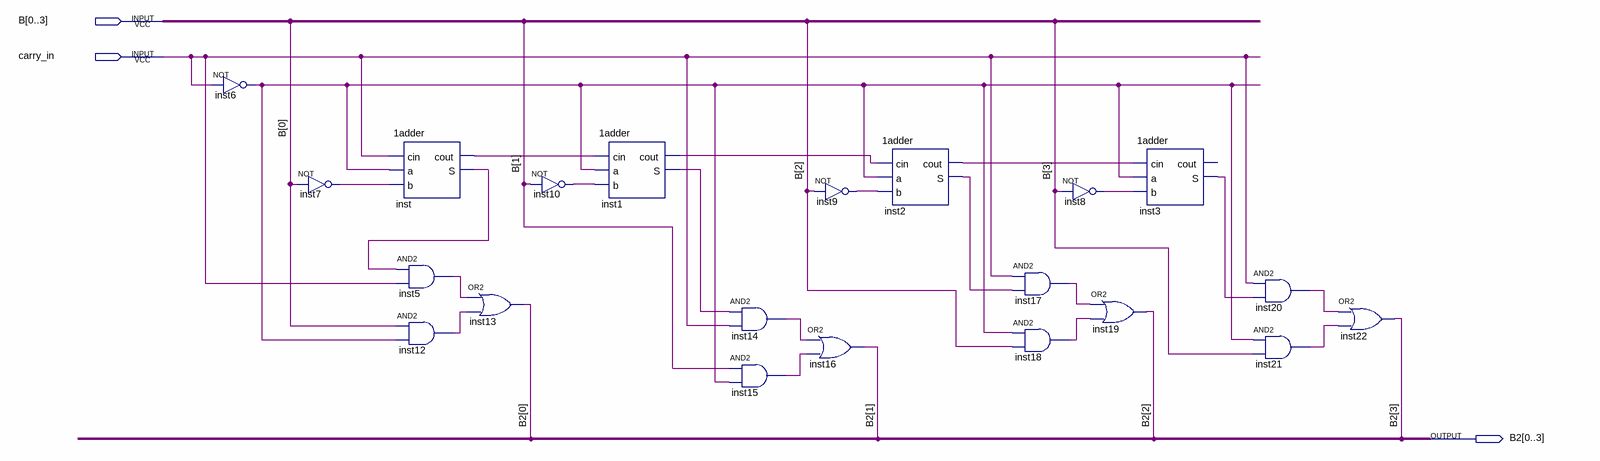
[diagram p0: schematic sheet]
// Quartus schematic complemento4bits.bdf as structural Verilog: 21 symbols, 3 pins
module complemento4bits (
  input  [0:3] B,
  input  carry_in,
  output [0:3] B2
);

  wire inst1_cout, inst1_s, inst2_cout, inst2_s, inst3_s, inst5_out, inst6_out, inst7_out, inst8_out,
       inst9_out, inst10_out, inst12_out, inst14_out, inst15_out, inst17_out, inst18_out, inst20_out,
       inst21_out, inst_cout, inst_s;

  not inst6 (inst6_out, carry_in);
  not inst7 (inst7_out, B[0]);
  \1adder  inst (.cin(carry_in), .a(inst6_out), .b(inst7_out), .cout(inst_cout), .S(inst_s));
  and inst5 (inst5_out, inst_s, carry_in);
  and inst12 (inst12_out, B[0], inst6_out);
  or inst13 (B2[0], inst5_out, inst12_out);
  not inst10 (inst10_out, B[1]);
  \1adder  inst1 (.cin(inst_cout), .a(inst6_out), .b(inst10_out), .cout(inst1_cout), .S(inst1_s));
  and inst14 (inst14_out, inst1_s, carry_in);
  and inst15 (inst15_out, B[1], inst6_out);
  or inst16 (B2[1], inst14_out, inst15_out);
  not inst9 (inst9_out, B[2]);
  \1adder  inst2 (.cin(inst1_cout), .a(inst6_out), .b(inst9_out), .cout(inst2_cout), .S(inst2_s));
  and inst17 (inst17_out, carry_in, inst2_s);
  and inst18 (inst18_out, inst6_out, B[2]);
  not inst8 (inst8_out, B[3]);
  or inst19 (B2[2], inst17_out, inst18_out);
  \1adder  inst3 (.cin(inst2_cout), .a(inst6_out), .b(inst8_out), .S(inst3_s));  // open: cout
  and inst20 (inst20_out, carry_in, inst3_s);
  and inst21 (inst21_out, inst6_out, B[3]);
  or inst22 (B2[3], inst20_out, inst21_out);
endmodule
